# Altium schematic sheet WIZ850io_SCH_V100.SchDoc
size A4; PageSetup: Record=PageOptions|CenterHorizontal=True|CenterVertical=True|PrintScale=0.97|XCorrection=1.00|YCorrection=1.00|PrintKind=1|BorderSize=5000000|LeftOffset=0|BottomOffset=0|Orientation=2|PaperLength=1000|PaperWidth=1000|Scale=100|PaperSource=7|PrintQuality=-3|MediaType=1|DitherType=10|PrintScaleMode=1|PaperKind=A4|PaperIndex=9
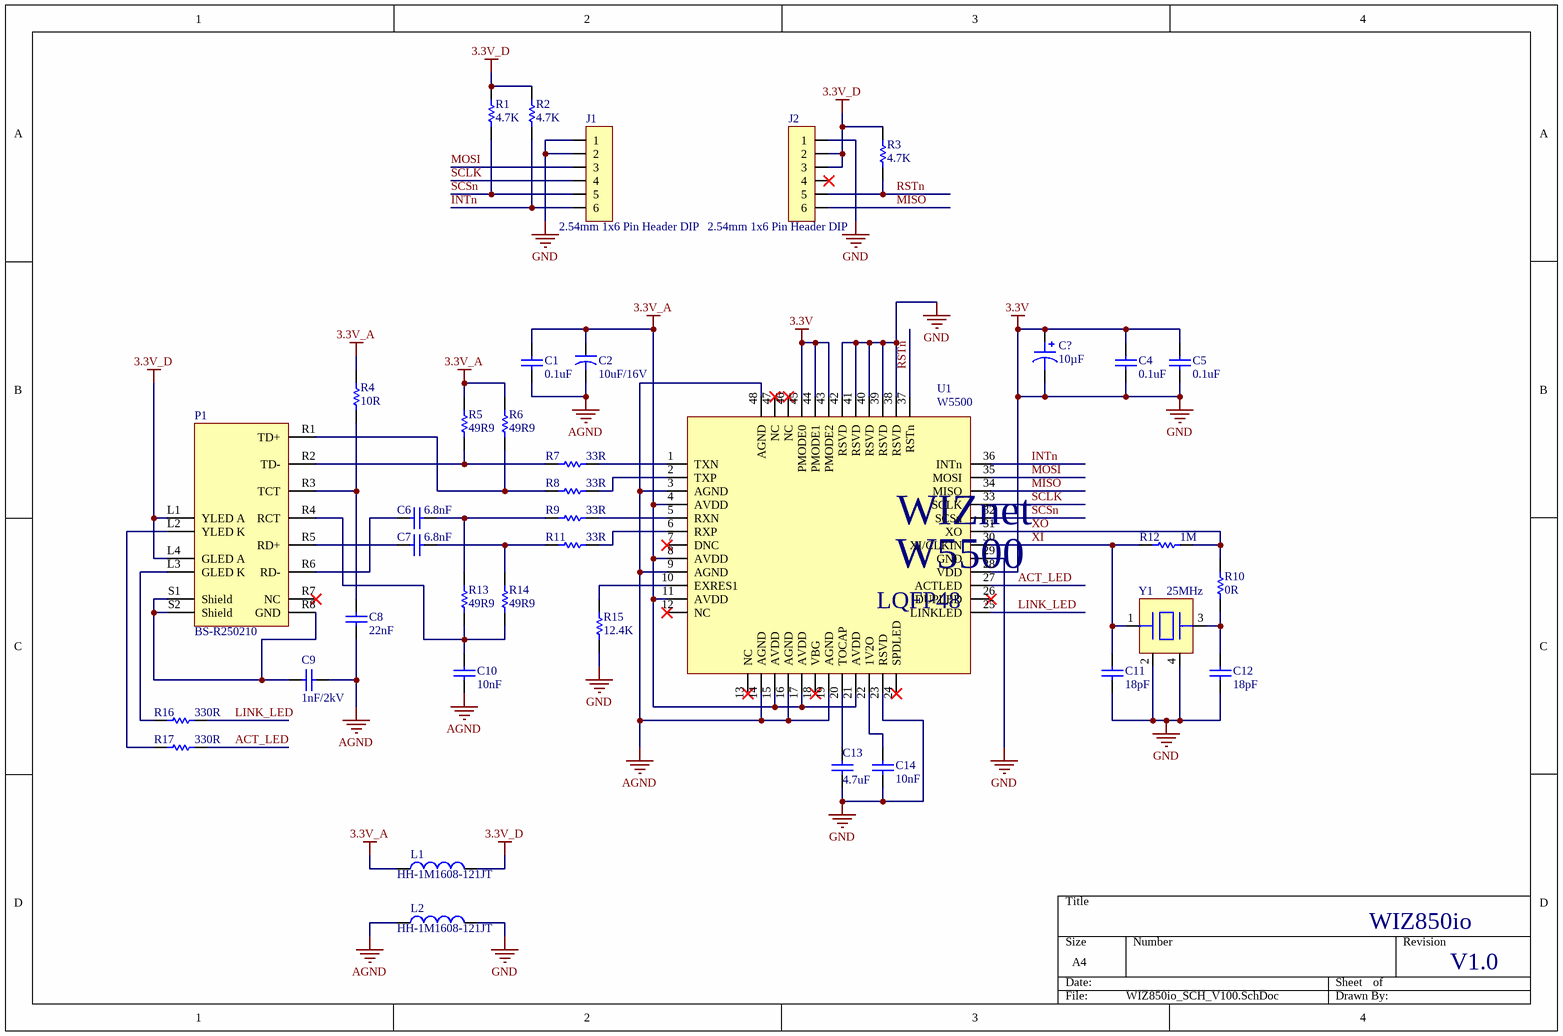
[diagram p0: WIZ850io_SCH_V100.SchDoc]

## Parts
C1  0.1uF  [CAP-0402]
C2  10uF/16V  [CAP-A Size]
C4  0.1uF  [CAP-0402]
C5  0.1uF  [CAP-0402]
C6  6.8nF  [CAP-0402]
C7  6.8nF  [CAP-0402]
C8  22nF  [CAP-0402]
C9  1nF/2kV  [CAP-1808]
C10  10nF  [CAP-0402]
C11  18pF  [CAP-0402]
C12  18pF  [CAP-0402]
C13  4.7uF  [CAP-0805]
C14  10nF  [CAP-0402]
C?  10µF  [CAP POL 1411_3528]
J1  2.54mm 1x6 Pin Header DIP  [IDC-1X6]
J2  2.54mm 1x6 Pin Header DIP  [IDC-1X6]
L1  HH-1M1608-121JT  [IND-0603]
L2  HH-1M1608-121JT  [IND-0603]
P1  BS-R250210  [BS-R250210]
R1  4.7K  [RES-0402]
R2  4.7K  [RES-0402]
R3  4.7K  [RES-0402]
R4  10R  [RES-0402]
R5  49R9  [RES-0402]
R6  49R9  [RES-0402]
R7  33R  [RES-0402]
R8  33R  [RES-0402]
R9  33R  [RES-0402]
R10  0R  [RES-0402]
R11  33R  [RES-0402]
R12  1M  [RES-0402]
R13  49R9  [RES-0402]
R14  49R9  [RES-0402]
R15  12.4K  [RES-0402]
R16  330R  [RES-0402]
R17  330R  [RES-0402]
U1  W5500  [WIZnet W5500]
Y1  25MHz  [OSC-82J0626]

## Nets
3.3V: C4.1 C4.2 C5.1 C5.2 C11.1 C12.1 C13.1 C14.1 C?.1 C?.2 J1.1 J1.2 J2.1 L2.2 R15.1 U1.23(RSVD) U1.28(VDD) U1.29(GND) U1.38(RSVD) U1.39(RSVD) U1.40(RSVD) U1.41(RSVD) U1.42(RSVD) U1.43(PMODE2) U1.44(PMODE1) U1.45(PMODE0) Y1.2 Y1.4  [also labelled GND]
3.3V_A: C1.2 C2.1 L1.1 R4.2 R5.2 R6.2 U1.4(AVDD) U1.8(AVDD) U1.11(AVDD) U1.15(AVDD) U1.17(AVDD) U1.21(AVDD)
3.3V_D: J2.2 J2.3 L1.2 P1.L1(YLED_A) P1.L4(GLED_A) R1.2 R2.2 R3.2
AGND: C1.1 C2.2 C8.1 C9.1 C10.1 L2.1 U1.3(AGND) U1.9(AGND) U1.14(AGND) U1.16(AGND) U1.19(AGND) U1.48(AGND)
ACT_LED: R17.2 U1.27(ACTLED)
INTn: J1.6 R2.1 U1.36(INTn)
LINK_LED: R16.2 U1.25(LINKLED)
MISO: J2.6 U1.34(MISO)
MOSI: J1.3 U1.35(MOSI)
RSTn: J2.5 R3.1 U1.37(RSTn)
SCLK: J1.4 U1.33(SCLK)
SCSn: J1.5 R1.1 U1.32(SCSn)
XI: C11.2 R12.1 U1.30(XI/CLKIN) Y1.1
XO: R10.2 R12.2 U1.31(XO)
NetC6_1: C6.1 P1.R6(RD-)
NetC6_2: C6.2 R9.1 R13.2
NetC7_1: C7.1 P1.R5(RD+)
NetC7_2: C7.2 R11.1 R14.2
NetC8_2: C8.2 P1.R3(TCT) R4.1
NetC9_2: C9.2 P1.R8(GND) P1.S1(Shield) P1.S2(Shield)
NetC10_2: C10.2 P1.R4(RCT) R13.1 R14.1
NetC12_2: C12.2 R10.1 Y1.3
NetC13_2: C13.2 U1.20(TOCAP)
NetC14_2: C14.2 U1.22(1V2O)
NetP1_L2: P1.L2(YLED_K) R17.1
NetP1_L3: P1.L3(GLED_K) R16.1
NetP1_R1: P1.R1(TD+) R6.1 R8.1
NetP1_R2: P1.R2(TD-) R5.1 R7.1
NetR7_2: R7.2 U1.1(TXN)
NetR8_2: R8.2 U1.2(TXP)
NetR9_2: R9.2 U1.5(RXN)
NetR11_2: R11.2 U1.6(RXP)
NetR15_2: R15.2 U1.10(EXRES1)

Not connected (* = marked no-connect by the designer): J2 4*; P1 R7(NC)*; U1 7(DNC)* 12(NC)* 13(NC)* 18(VBG)* 24(SPDLED)* 26(DUPLED)* 46(NC)* 47(NC)*

## Notes on the sheet
- WIZ850io
- V1.0
- (in symbol W5500) WIZnet; LQFP48

## Library data of the parts
C1 C4-C8 C10-C13 = CAP-0402: Ceramic CAP 0402(1005)
C2 = CAP-A Size: Tantla CAP A Size EIA/IECQ 3216
C9 = CAP-1808: Ceramic CAP 1808(4520)
C14 = CAP-0805: Ceramic CAP 0805(2012)
C? = T491B106K016ATAUTO: CAP TANT 10UF 10% 16V 1411; Manufacturer: KEMET; Manufacturer Size Code: B; ESR (Equivalent Series Resistance): 2.5Ohm; Lifetime @ Temp.: 2000 Hrs @ 125°C; Type: Molded; Part Number: T491B106K016ATAUTO; Value: 10µF; Capacitance: 10µF; ComponentLink1Description: Datasheet; ComponentLink1URL: https://api.kemet.com/component-edge/download/datasheet/T491B106K016ATAUTO.pdf; ComponentLink2Description: DigiKey Link; ComponentLink2URL: http://digikey.com/product-detail/en/kemet/T491B106K016ATAUTO/399-18036-1-ND/9342305; Device Package: 1411 (3528 Metric); Features: Automotive; Height - Seated (Max): 0.083" (2.10mm); LastUpdated: 2020-01-21 1:52:37 AM; Lifecycle Status: Active; Minimum Order: 1; Mounting Type: Surface Mount; Operating Temperature: -55°C ~ 125°C; Package / Case: 1411 (3528 Metric); Packaging: TapeAndReel; PartId: 1682; Part Status: Active; Price: 0.15; Ratings: AEC-Q200; Series: T491; Size / Dimension: 0.138" L x 0.110" W (3.50mm x 2.80mm); Supplier 1: DigiKey; Supplier Part Number 1: 399-18036-1-ND; Tolerance: ±10%; Voltage - Rated: 16V
L1 L2 = IND-0603: Inductor 0603(1608)
R1-R17 = RES-0402
U1 = W5500: WIZnet W5500
Y1 = OSC-82J0626-25MHz: X-tal 25MHz,3.2x2.5 SMD, CL=18pF